# Altium schematic sheet MCU.SchDoc
size A3; SheetNumber: 2; SheetTotal: 7
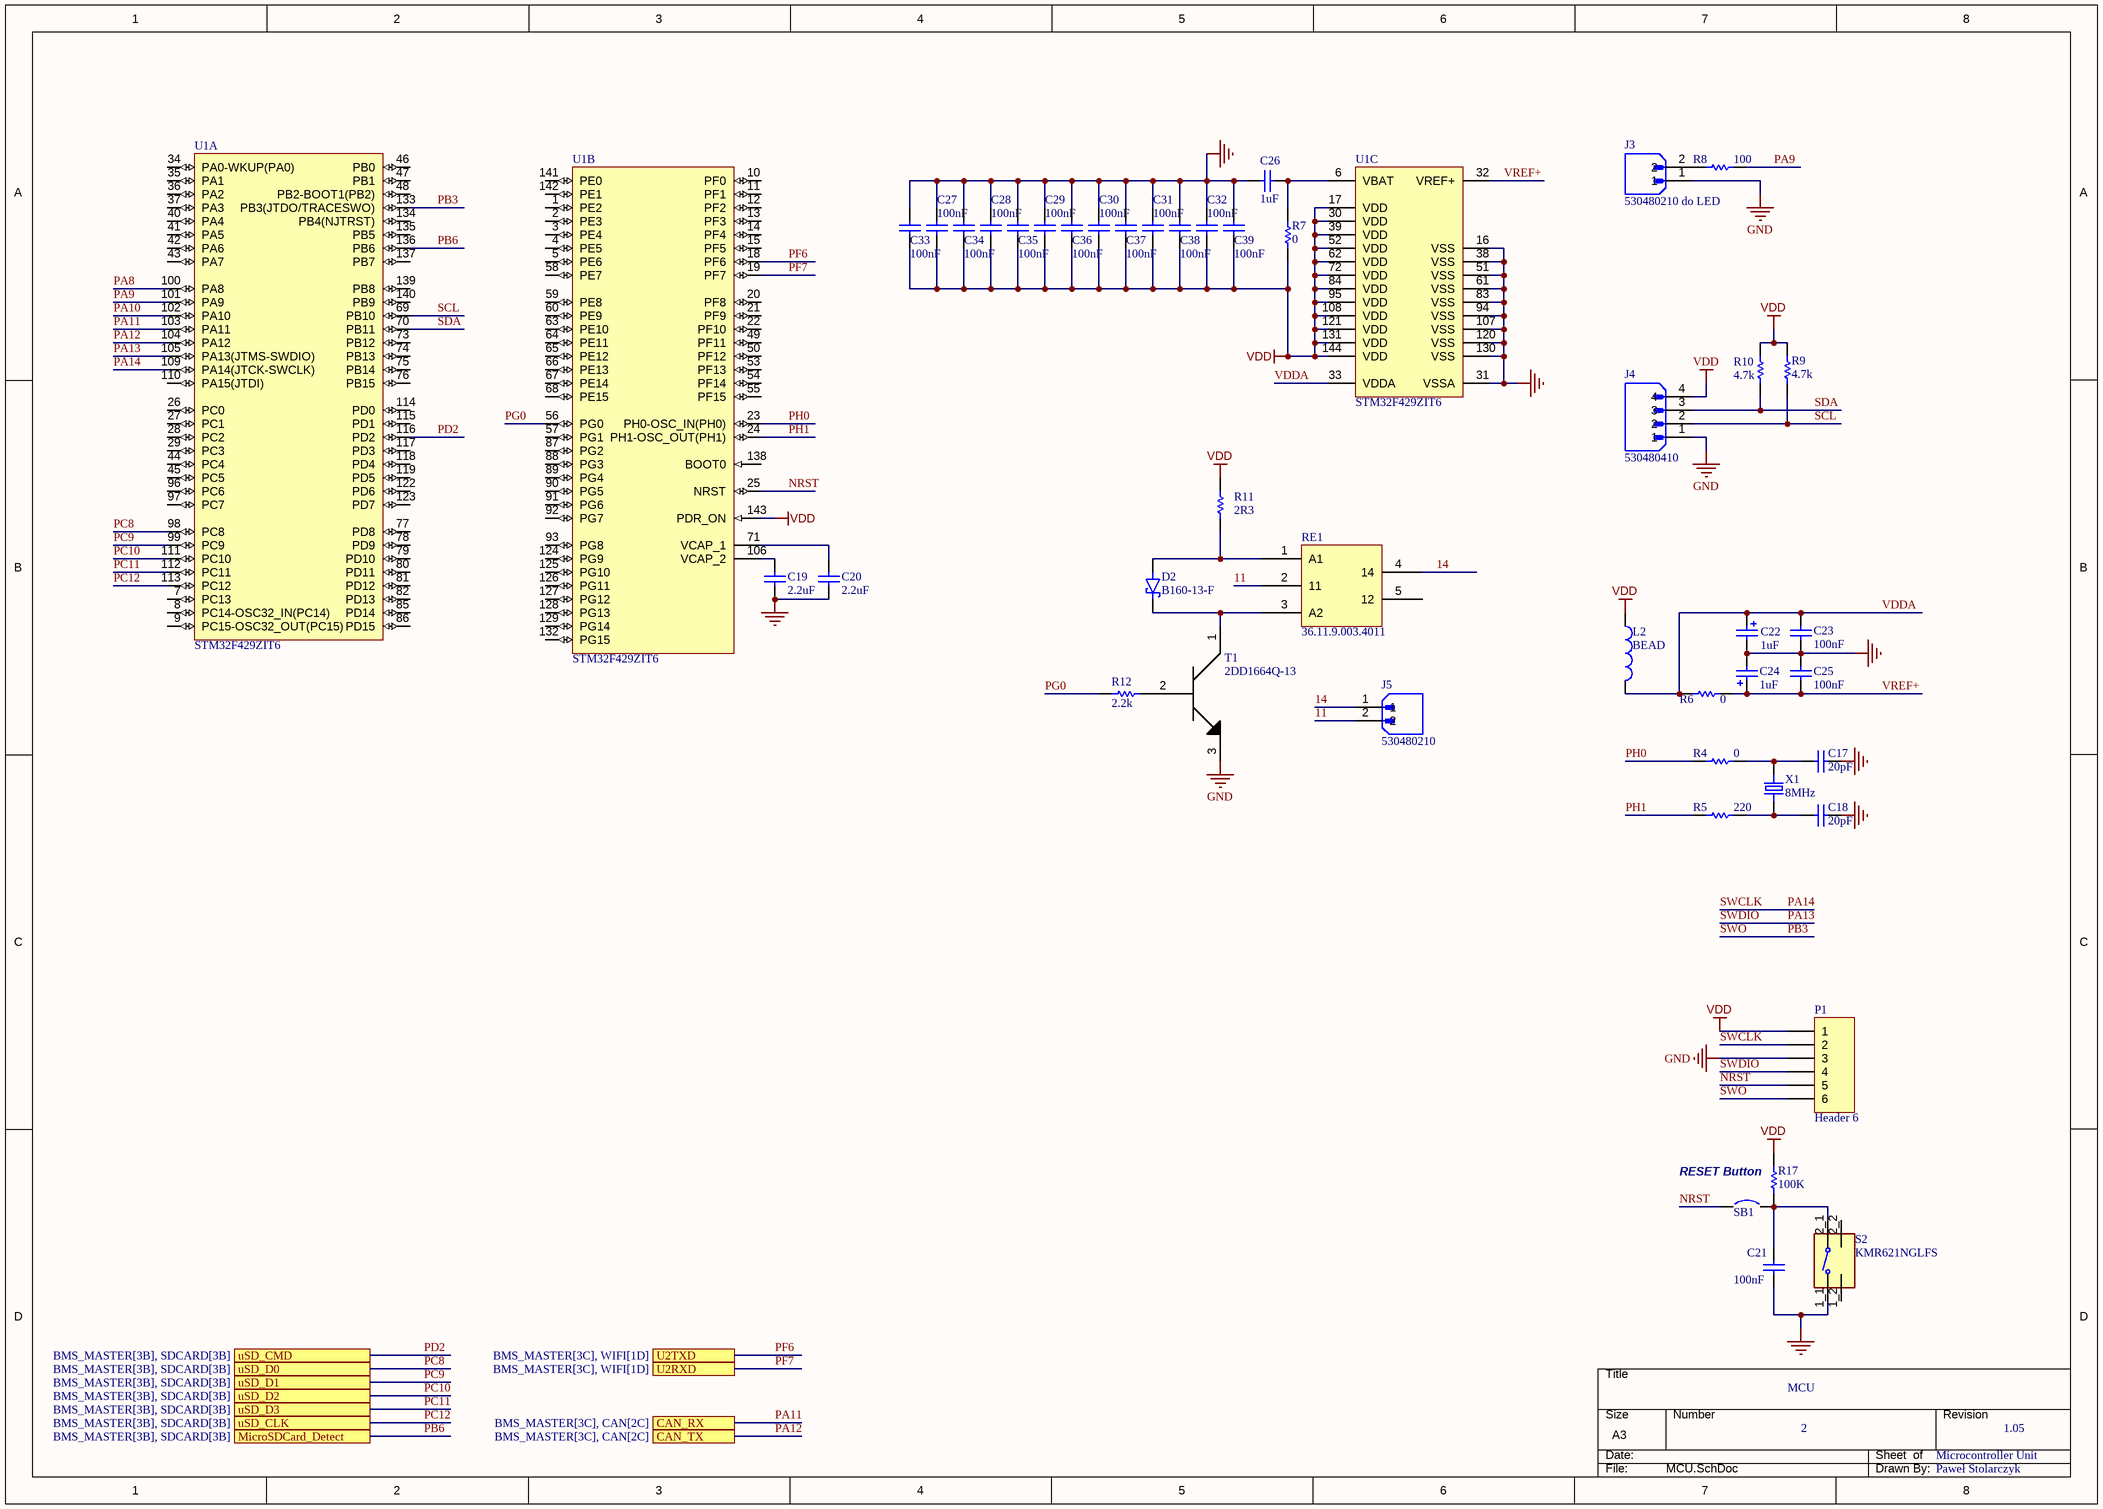
[diagram p0: MCU.SchDoc]

## Parts
C17  20pF  [0402]
C18  20pF  [0402]
C19  2.2uF  [C1206]
C20  2.2uF  [C1206]
C21  100nF  [0402]
C22  1uF  [C1206]
C23  100nF  [0402]
C24  1uF  [C1206]
C25  100nF  [0402]
C26  1uF  [C1206]
C27  100nF  [0402]
C28  100nF  [0402]
C29  100nF  [0402]
C30  100nF  [0402]
C31  100nF  [0402]
C32  100nF  [0402]
C33  100nF  [0402]
C34  100nF  [0402]
C35  100nF  [0402]
C36  100nF  [0402]
C37  100nF  [0402]
C38  100nF  [0402]
C39  100nF  [0402]
D2  B160-13-F  [DIODE_B160-13-F]
J3  530480210 do LED  [MOLEX_530480210]
J4  530480410  [MOLEX_530480410]
J5  530480210  [MOLEX_530480210]
L2  BEAD  [0402]
P1  Header 6  [HDR1X6]
R4  0  [0402]
R5  220  [0402]
R6  0  [0402]
R7  0  [0402]
R8  100  [0402]
R9  4.7k  [0402]
R10  4.7k  [0402]
R11  value 2R3  [C1206]  (hidden comment: Res1)
R12  2.2k  [0402]
R17  100K  [0402]
RE1  36.11.9.003.4011  [36.11.9.003.4011]
S2  KMR621NGLFS  [SW_KMR621NGLFS]
SB1  Circuit Breaker  [0402]  (value not drawn)
T1  2DD1664Q-13  [SOT150P410X160-3N]
U1  STM32F429ZIT6  [STM-LQFP144_N]  (parts A,B,C of 3)
X1  8MHz  [8M-49S-SR]

## Ports
CAN_RX (see BMS_MASTER[3C], CAN[2C]), CAN_TX (see BMS_MASTER[3C], CAN[2C]), MicroSDCard_Detect (see BMS_MASTER[3B], SDCARD[3B]), U2RXD (see BMS_MASTER[3C], WIFI[1D]), U2TXD (see BMS_MASTER[3C], WIFI[1D]), uSD_CLK (see BMS_MASTER[3B], SDCARD[3B]), uSD_CMD (see BMS_MASTER[3B], SDCARD[3B]), uSD_D0 (see BMS_MASTER[3B], SDCARD[3B]), uSD_D1 (see BMS_MASTER[3B], SDCARD[3B]), uSD_D2 (see BMS_MASTER[3B], SDCARD[3B]), uSD_D3 (see BMS_MASTER[3B], SDCARD[3B])

## Nets
GND: C17.2 C18.2 C19.2 C20.2 C21.1 C22.2 C23.1 C24.2 C25.2 C26.1 C27.2 C28.2 C29.2 C30.2 C31.2 C32.2 C33.2 C34.2 C35.2 C36.2 C37.2 C38.2 C39.2 J3.1 J4.1 P1.3 S2.1_1 T1.3 U1.16(VSS) U1.31(VSSA) U1.38(VSS) U1.51(VSS) U1.61(VSS) U1.83(VSS) U1.94(VSS) U1.107(VSS) U1.120(VSS) U1.130(VSS)
VDD: C27.1 C28.1 C29.1 C30.1 C31.1 C32.1 C33.1 C34.1 C35.1 C36.1 C37.1 C38.1 C39.1 J4.4 L2.1 P1.1 R7.1 R9.1 R10.1 R11.2 R17.2 U1.17(VDD) U1.30(VDD) U1.39(VDD) U1.52(VDD) U1.62(VDD) U1.72(VDD) U1.84(VDD) U1.95(VDD) U1.108(VDD) U1.121(VDD) U1.131(VDD) U1.143(PDR_ON) U1.144(VDD)
11: J5.2 RE1.2(11)
14: J5.1 RE1.4(14)
NRST: P1.5 SB1.1 U1.25(NRST)
PA8: U1.100(PA8)
PA9: R8.2 U1.101(PA9)
PA10: U1.102(PA10)
PA11: U1.103(PA11) ; port CAN_RX
PA12: U1.104(PA12) ; port CAN_TX
PA13: P1.4 U1.105(PA13(JTMS-SWDIO))  [also labelled SWDIO]
PA14: P1.2 U1.109(PA14(JTCK-SWCLK))  [also labelled SWCLK]
PB3: P1.6 U1.133(PB3(JTDO/TRACESWO))  [also labelled SWO]
PB6: U1.136(PB6) ; port MicroSDCard_Detect
PC8: U1.98(PC8) ; port uSD_D0
PC9: U1.99(PC9) ; port uSD_D1
PC10: U1.111(PC10) ; port uSD_D2
PC11: U1.112(PC11) ; port uSD_D3
PC12: U1.113(PC12) ; port uSD_CLK
PD2: U1.116(PD2) ; port uSD_CMD
PF6: U1.18(PF6) ; port U2TXD
PF7: U1.19(PF7) ; port U2RXD
PG0: R12.1 U1.56(PG0)
PH0: R4.1 U1.23(PH0-OSC_IN(PH0))
PH1: R5.1 U1.24(PH1-OSC_OUT(PH1))
SCL: J4.2 R9.2 U1.69(PB10)
SDA: J4.3 R10.2 U1.70(PB11)
VDDA: C22.1 C23.2 L2.2 R6.1 U1.33(VDDA)
VREF+: C24.1 C25.1 R6.2 U1.32(VREF+)
NetC17_1: C17.1 R4.2 X1.2
NetC18_1: C18.1 R5.2 X1.1
NetC19_1: C19.1 U1.106(VCAP_2)
NetC20_1: C20.1 U1.71(VCAP_1)
NetC21_2: C21.2 R17.1 S2.2_1 SB1.2
NetC26_2: C26.2 R7.2 U1.6(VBAT)
NetD2_1: D2.1(C) RE1.3(A2) T1.1
NetD2_2: D2.2(A) R11.1 RE1.1(A1)
NetJ3_2: J3.2 R8.1
NetR12_2: R12.2 T1.2

Not connected (* = marked no-connect by the designer): RE1 5(12); S2 1_2(1) 2_2(2); U1 1(PE2) 2(PE3) 3(PE4) 4(PE5) 5(PE6) 7(PC13) 8(PC14-OSC32_IN(PC14)) 9(PC15-OSC32_OUT(PC15)) 10(PF0) 11(PF1) 12(PF2) 13(PF3) 14(PF4) 15(PF5) 20(PF8) 21(PF9) 22(PF10) 26(PC0) 27(PC1) 28(PC2) 29(PC3) 34(PA0-WKUP(PA0)) 35(PA1) 36(PA2) 37(PA3) 40(PA4) 41(PA5) 42(PA6) 43(PA7) 44(PC4) 45(PC5) 46(PB0) 47(PB1) 48(PB2-BOOT1(PB2)) 49(PF11) 50(PF12) 53(PF13) 54(PF14) 55(PF15) 57(PG1) 58(PE7) 59(PE8) 60(PE9) 63(PE10) 64(PE11) 65(PE12) 66(PE13) 67(PE14) 68(PE15) 73(PB12) 74(PB13) 75(PB14) 76(PB15) 77(PD8) 78(PD9) 79(PD10) 80(PD11) 81(PD12) 82(PD13) 85(PD14) 86(PD15) 87(PG2) 88(PG3) 89(PG4) 90(PG5) 91(PG6) 92(PG7) 93(PG8) 96(PC6) 97(PC7) 110(PA15(JTDI)) 114(PD0) 115(PD1) 117(PD3) 118(PD4) 119(PD5) 122(PD6) 123(PD7) 124(PG9) 125(PG10) 126(PG11) 127(PG12) 128(PG13) 129(PG14) 132(PG15) 134(PB4(NJTRST)) 135(PB5) 137(PB7) 138(BOOT0) 139(PB8) 140(PB9) 141(PE0) 142(PE1)

## Notes on the sheet
- RESET Button
- MCU
- 2
- Microcontroller Unit
- 1.05
- Paweł Stolarczyk
- DWG. NO.
- REV.
- SHT.
- THIS DOCUMENT AND THE DATA DISCLOSED HEREIN OR HEREWITH IS THE PROPERTY OF ALTIUM LIMITED AND MAY BE FREELY DISTRIBUTED IN WHOLE. NO RIGHTS ARE RESERVED OR EXPRESS OR IMPLIED WARANTEE GIVEN.
- REVISION
- DESCRIPTION
- DATE
- APPROVED
- ENG:
- APPROVALS
- PROJECT
- DSN:
- CHK:
- REFERENCE DOCUMENTS
- PROJECT REVISION:
- TITLE
- DOCUMENT REVISION:
- DESIGN ITEM:
- BOM:
- FAB DWG:
- PCB DWG:
- ASSY DWG:
- SCALE:
- SIZE
- B
- CAGE CODE
- FILE NAME
- DWG NO.
- SHEET
- OF
- REV

## Library data of the parts
C17 C18 C26 = Capacitor_ST: Capacitor 0402 / 0603 / 0805; Value: 100nF; Revision: July-2002: Re-released for DXP Platform.
C19 C20 = Cap Low ESR: Low ESR Ceramic Capacitor (X7R); Order: CC1206KKX7R7BB225; Revision: July-2002: Re-released for DXP Platform.; Value: 2.2uF; Distrib: FARNELL; Manuf_Part_1: CC1206KKX7R7BB225; Manuf_1: www.yageo.com
C21 C23 C25 C27-C39 = Capacitor_ST: Capacitor 0402 / 0603 / 0805; Revision: July-2002: Re-released for DXP Platform.; Value: 100nF
C22 C24 = Cap Pol1: Polarized Capacitor (Radial); Value: 10uF; Published: 8-Jun-2000; Revision: July-2002: Re-released for DXP Platform.; Publisher: Altium Limited
D2 = B160-13-F: Diode Schottky 60V 1A Surface Mount SMA; MF: Diodes Inc.; Price: None; Availability: Unavailable; SnapEDA_Link: https://www.snapeda.com/parts/B160-13-F/Diodes%20Inc./view-part/248179/?ref=snap; MP: B160-13-F; Value: *; Package: DO-214 Diodes Inc.
J3 J5 = 530480210: Conn Shrouded Header (4 Sides) HDR 2 POS 1.25mm Solder RA Side Entry Thru-Hole PicoBladeâ„¢ Tray; MF: Molex; SnapEDA_Link: https://www.snapeda.com/parts/530480210/Molex/view-part/?ref=snap; Value: *; Purchase-URL: https://pricing.snapeda.com/search/part/530480210/?ref=eda; Check_prices: https://www.snapeda.com/parts/530480210/Molex/view-part/?ref=eda; Availability: In Stock; Price: None; MP: 530480210; Package: None
L2 = Inductor: Manuf_Part_1: FCM1608KF-601T03; Value: 100uH; Published: 8-Jun-2000; Revision: July-2002: Re-released for DXP Platform.; Publisher: Altium Limited; Order: FCM1608KF-601T03
P1 = Header 6: Header, 6-Pin; LatestRevisionDate: 17-Jul-2002; LatestRevisionNote: Re-released for DXP Platform.; Publisher: Altium Limited
R4-R10 R12 R17 = Resistor_ST: Resistor 0402 / 0603 / 0805; Value: 10K
R11 = Res1: Resistor; Published: 8-Jun-2000; LatestRevisionDate: 17-Jul-2002; LatestRevisionNote: Re-released for DXP Platform.; PackageReference: AXIAL-0.3; Publisher: Altium Limited; PackageDescription: Axial Device, Thru-Hole; 2 Leads; 0.3 in Pin Spacing
RE1 = 36.11.9.003.4011: Przekaźnik: elektromagnetyczny; SPDT; Ucewki : 3VDC; 15A; PCB; 25Ω
S2 = KMR621NGLFS: Tactile Switch SPST-NO Top Actuated Surface Mount; MF: C&K; Package: None; Value: *; Price: None; MP: KMR621NG LFS; SnapEDA_Link: https://www.snapeda.com/parts/KMR621NG%20LFS/C%26K/view-part/2720743/?ref=snap; Availability: Unavailable
SB1 = Circuit Breaker: Solder: YES; Published: 24-Mar-1999; Revision: July-2002: Re-released for DXP Platform.; Publisher: Altium Limited
T1 = 2DD1664Q-13: Transistor: NPN; bipolar; 32V; 1A; 1W; SOT89; automotive industry
U1 = STM32F429ZIT6: ARM Cortex-M4 32-bit MCU+FPU, 225 DMIPS, 2048 kB Flash, 256 kB Internal RAM, 114 I/Os, 144-pin LQFP, -40 to 85 degC, Tray; Manufacturer: STMicroelectronics; D/A Converter: 2x12-bit; FLASH Size (Prog) (kB): 2048; I/Os (High Current): 114; Internal RAM Size (kB): 256; Operating Frequency(F) (Processor speed) (MHz): 180; Supply Voltage(Vcc) max (V): 3.6; Supply Voltage(Vcc) min (V): 1.8; DatasheetVersion: Rev. 2; PackageVersion: Rev. 4, 06/2013; PackageReference: LQFP144; PackageDescription: 144-Pin Low Profile Quad Flat Package, 20 x 20 mm Body, 0.5 mm Pitch; Supplier 1: Digi-Key; Supplier Part Number 1: 497-14053-ND; Supplier 2: Newark; Supplier Part Number 2: 06X3676; Supplier 3: Mouser; Supplier Part Number 3: 511-STM32F429ZIT6; Core: ARM Cortex-M4; Packing: Tray; Mounting Technology: Surface Mount; PartNumber: STM32F429ZIT6; ComponentLink1Description: Manufacturer URL; ComponentLink1URL: http://www.st.com/web/en/home.html; ComponentLink2Description: Datasheet; ComponentLink2URL: http://www.st.com/st-web-ui/static/active/en/resource/technical/document/data_brief/DM00053488.pdf; ComponentLink3Description: Package Specification; ComponentLink3URL: http://www.st.com/st-web-ui/static/active/en/resource/technical/document/datasheet/DM00037051.pdf
X1 = 8M-49S-SR: 8MHz; ±30ppm; 20pF; THT; HC49-S; MF: ECS Inc.; MP: ECS-160-20-4VX; SnapEDA_Link: https://www.snapeda.com/parts/ECS-160-20-4VX/ECS%20Inc./view-part/47293/?ref=snap; Availability: Unavailable; Value: *; Price: None; Package: HC49/US ECS International
J4 = 530480410: Availability: Unavailable; Price: None; Package: None; Value: *; MP: 530480410